# Altium schematic sheet SV601121A.SchDoc: BUCK/BOOST CONVERTER HIGH DENSITY
size 431 x 279 mm; DrawnBy: Alan Cuperus; DocumentNumber: 2; Revision: A; SheetNumber: 2; SheetTotal: 2; PageSetup: Record=PageOptions|CenterHorizontal=True|CenterVertical=True|PrintScale=0.62|XCorrection=1.00|YCorrection=1.00|PrintKind=0|BorderSize=5000000|LeftOffset=0|BottomOffset=0|Orientation=2|PaperLength=1000|PaperWidth=1000|Scale=100|PaperSource=15|PrintQuality=600|MediaType=1|DitherType=10|PaperKind=Letter (8.5 x 11")|PrintScaleMode=1
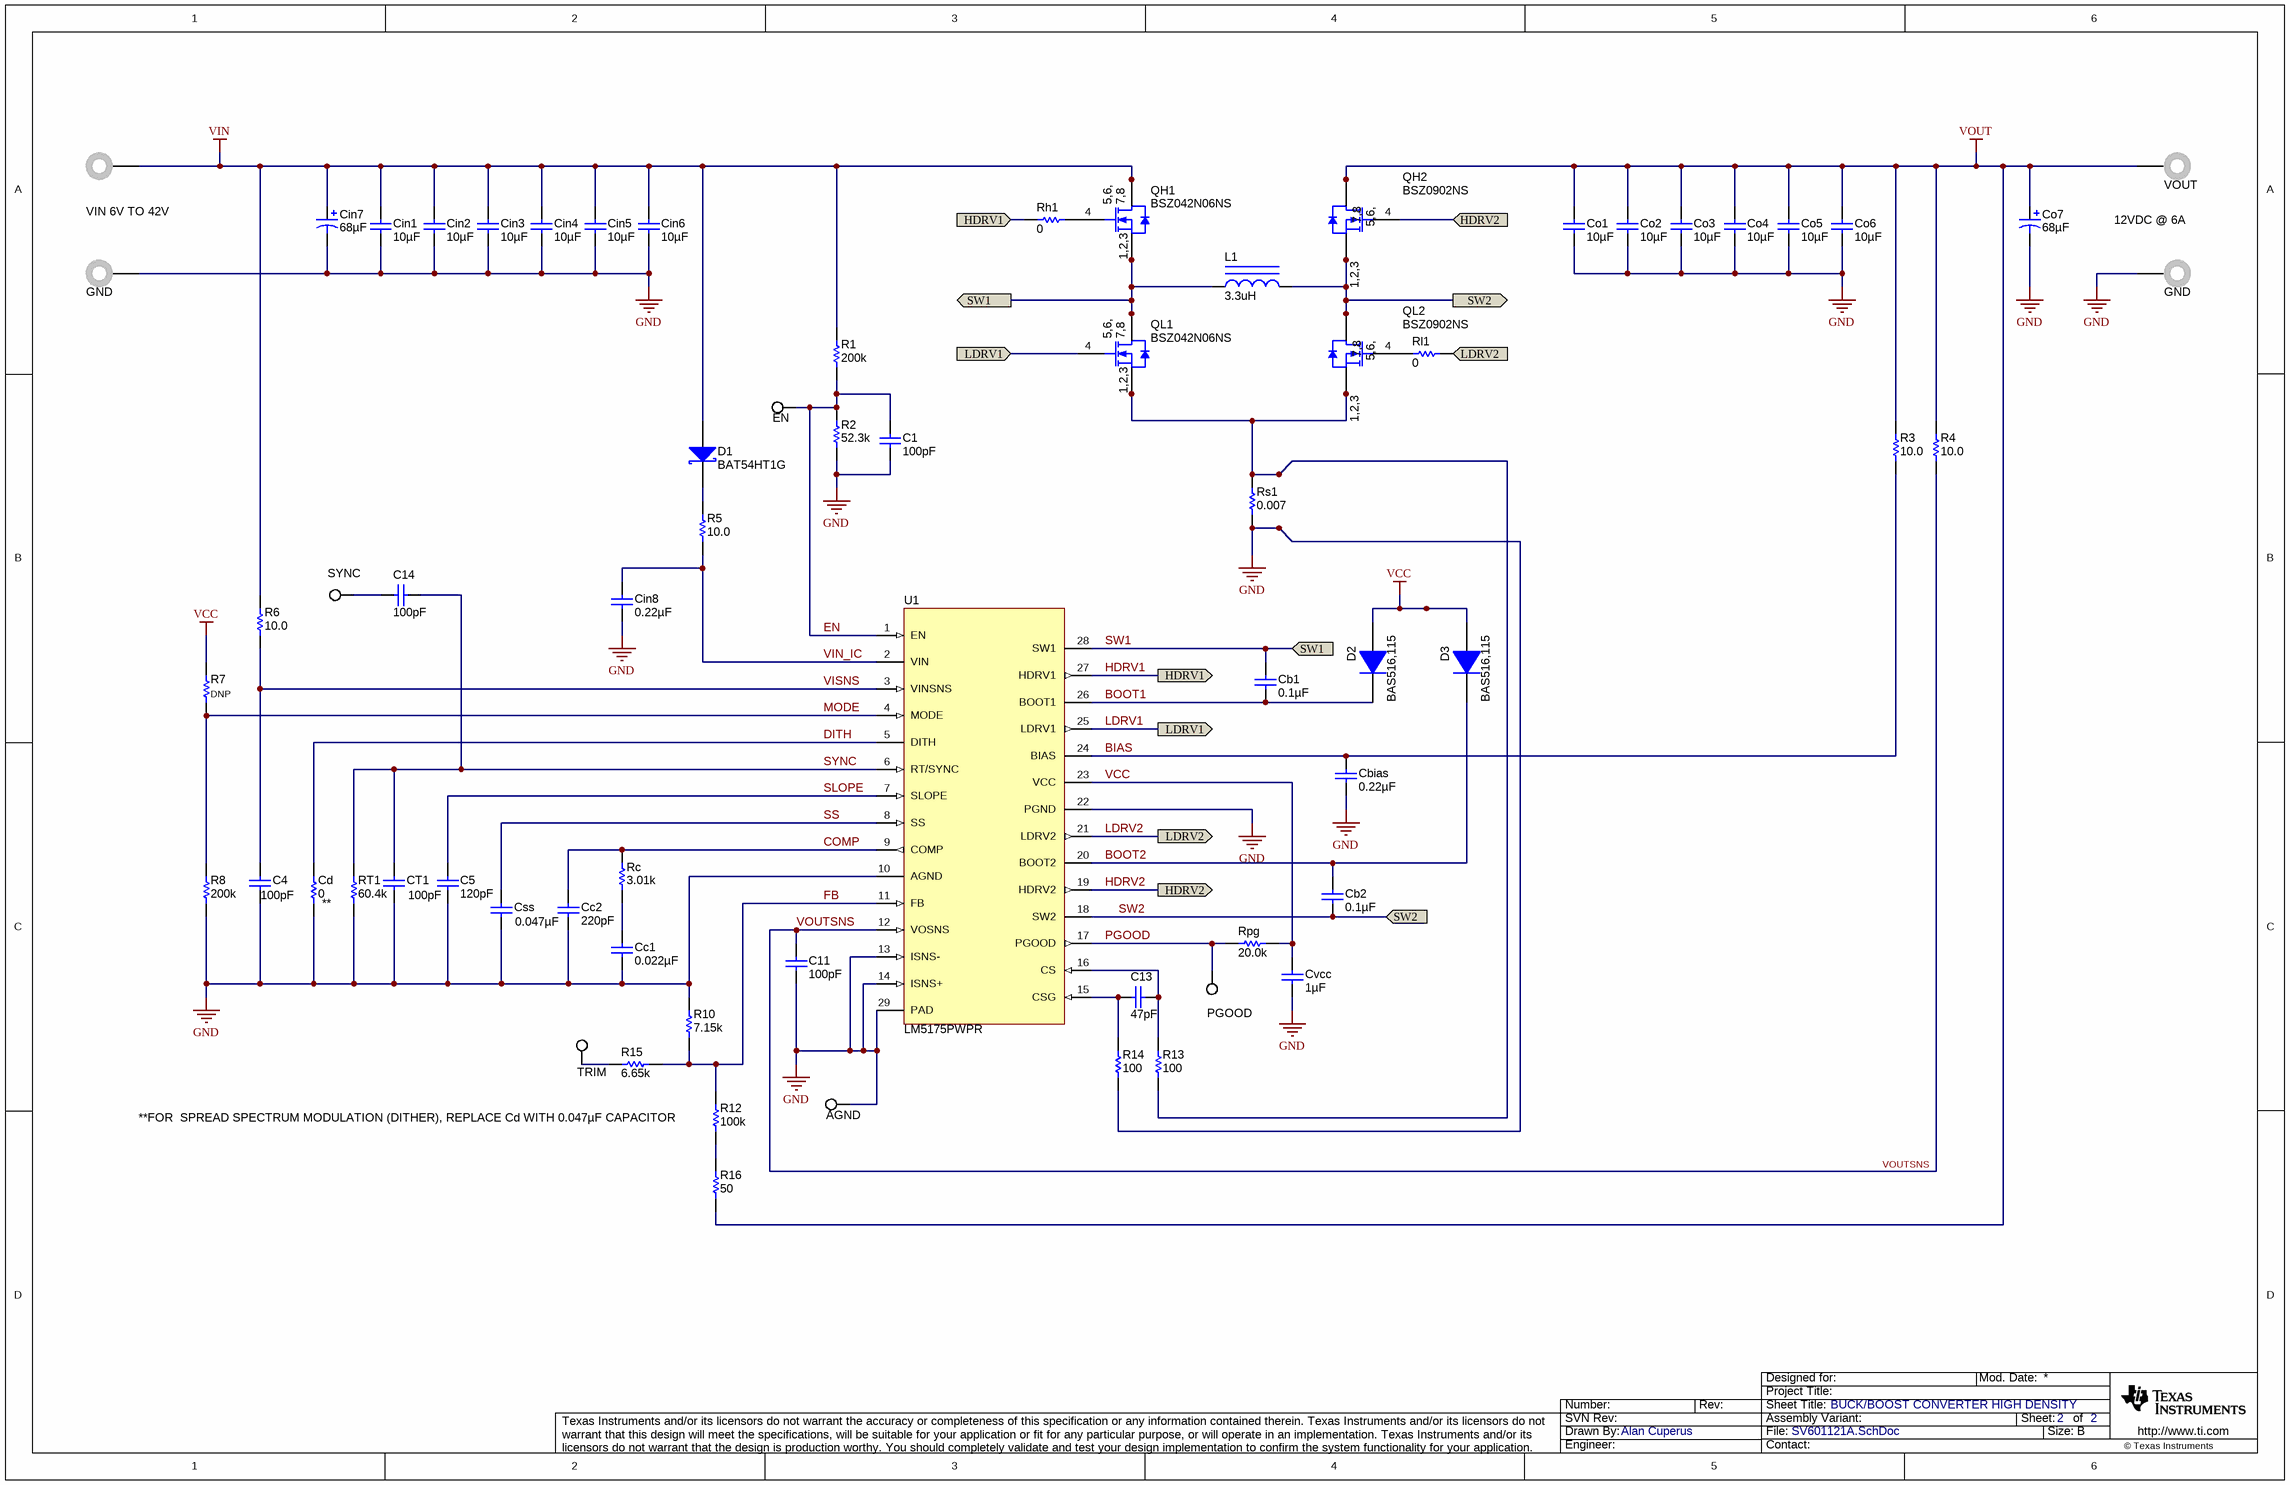
[diagram p0: SV601121A.SchDoc]

## Parts
AGND  5015  [Testpoint_Keystone_Miniature]  (value not drawn)
C1  ValueDisplayed: 100pF  [0603L]  (hidden comment: GRM1885C1H101JA01D)
C4  ValueDisplayed: 100pF  [0603L]  (hidden comment: GRM1885C1H101JA01D)
C5  ValueDisplayed: 120pF  [0603L]  (hidden comment: GRM1885C1H121JA01D)
C11  ValueDisplayed: 100pF  [0603L]  (hidden comment: GRM1885C1H101JA01D)
C13  ValueDisplayed: 47pF  [0603L]  (hidden comment: GRM1885C1H470JA01D)
C14  ValueDisplayed: 100pF  [0603L]  (hidden comment: CGA3E2NP01H101J080AA)
Cb1  ValueDisplayed: 0.1µF  [0603L]  (hidden comment: GCM188R71H104KA57D)
Cb2  ValueDisplayed: 0.1µF  [0603L]  (hidden comment: GCM188R71H104KA57D)
Cbias  ValueDisplayed: 0.22µF  [0603_HV]  (hidden comment: C1608X7R1H224K080AB)
Cc1  ValueDisplayed: 0.022µF  [0603L]  (hidden comment: GRM188R71H223KA01D)
Cc2  ValueDisplayed: 220pF  [0603L]  (hidden comment: GRM1885C1H221JA01D)
Cd  ValueDisplayed: 0  [0603L]  (hidden comment: RC0603JR-070RL)
Cin1  ValueDisplayed: 10µF  [1210L]  (hidden comment: GRM32ER71H106KA12L)
Cin2  ValueDisplayed: 10µF  [1210L]  (hidden comment: GRM32ER71H106KA12L)
Cin3  ValueDisplayed: 10µF  [1210L]  (hidden comment: GRM32ER71H106KA12L)
Cin4  ValueDisplayed: 10µF  [1210L]  (hidden comment: GRM32ER71H106KA12L)
Cin5  ValueDisplayed: 10µF  [1210L]  (hidden comment: GRM32ER71H106KA12L)
Cin6  ValueDisplayed: 10µF  [1210L]  (hidden comment: GRM32ER71H106KA12L)
Cin7  ValueDisplayed: 68µF  [SM_RADIAL_8MM]  (hidden comment: EEHZC1H680P)
Cin8  ValueDisplayed: 0.22µF  [0603_HV]  (hidden comment: C1608X7R1H224K080AB)
Co1  ValueDisplayed: 10µF  [1210L]  (hidden comment: GRM32ER71H106KA12L)
Co2  ValueDisplayed: 10µF  [1210L]  (hidden comment: GRM32ER71H106KA12L)
Co3  ValueDisplayed: 10µF  [1210L]  (hidden comment: GRM32ER71H106KA12L)
Co4  ValueDisplayed: 10µF  [1210L]  (hidden comment: GRM32ER71H106KA12L)
Co5  ValueDisplayed: 10µF  [1210L]  (hidden comment: GRM32ER71H106KA12L)
Co6  ValueDisplayed: 10µF  [1210L]  (hidden comment: GRM32ER71H106KA12L)
Co7  ValueDisplayed: 68µF  [SM_RADIAL_8MM]  (hidden comment: EEHZC1H680P)
Css  ValueDisplayed: 0.047µF  [0603L]  (hidden comment: GRM188R71H473KA61D)
CT1  ValueDisplayed: 100pF  [0603L]  (hidden comment: DNP)
Cvcc  ValueDisplayed: 1µF  [0603L]  (hidden comment: GRM188R71C105KA12D)
D1  BAT54HT1G  [sod-323]
D2  BAS516,115  [SOD-523]
D3  BAS516,115  [SOD-523]
EN  5015  [Testpoint_Keystone_Miniature]  (value not drawn)
J1  VIN 6V TO 42V  [Johnson_108-0740-001]
J2  VOUT  [Johnson_108-0740-001]
J3  GND  [Johnson_108-0740-001]
J4  GND  [Johnson_108-0740-001]
L1  3.3uH  [PIMB135T]
PGOOD  5015  [Testpoint_Keystone_Miniature]  (value not drawn)
QH1  BSZ042N06NS  [PG-TSDSON-8]
QH2  BSZ0902NS  [PG-TSDSON-8]
QL1  BSZ042N06NS  [PG-TSDSON-8]
QL2  BSZ0902NS  [PG-TSDSON-8]
R1  value 200k  [0603_HV]  (hidden comment: RC0603FR-07200KL)
R2  ValueDisplayed: 52.3k  [0603_HV]  (hidden comment: RC0603FR-0752K3L)
R3  value 10.0  [0603_HV]  (hidden comment: RC0603FR-0710RL)
R4  ValueDisplayed: 10.0  [0603L]  (hidden comment: CRCW060310R0FKEA)
R5  value 10.0  [0603L]  (hidden comment: RC0603FR-0710RL)
R6  value 10.0  [0603L]  (hidden comment: RC0603FR-0710RL)
R7  value DNP  [0603L]  (hidden comment: CRCW06030000Z0EA)
R8  ValueDisplayed: 200k  [0603L]  (hidden comment: CRCW0603200KFKEA)
R10  value 7.15k  [0603L]  (hidden comment: RC0603FR-077K15L)
R12  value 100k  [0603L]  (hidden comment: RC0603FR-07100KL)
R13  value 100  [0603L]  (hidden comment: RC0603FR-07100RL)
R14  value 100  [0603L]  (hidden comment: RC0603FR-07100RL)
R15  ValueDisplayed: 6.65k  [0603L]  (hidden comment: RC0603FR-076K65L)
R16  ValueDisplayed: 50  [0603L]  (hidden comment: CRCW060350R0FKEA)
Rc  value 3.01k  [0603L]  (hidden comment: RC0603FR-073K01L)
Rh1  value 0  [0603L]  (hidden comment: CRCW06030000Z0EA)
Rl1  value 0  [0603L]  (hidden comment: CRCW06030000Z0EA)
Rpg  ValueDisplayed: 20.0k  [0603L]  (hidden comment: RC0603FR-0720KL)
Rs1  0.007  [2512_WIDE]
RT1  ValueDisplayed: 60.4k  [0603L]  (hidden comment: RC0603FR-0760K4L)
SYNC  5015  [Testpoint_Keystone_Miniature]  (value not drawn)
TRIM  5015  [Testpoint_Keystone_Miniature]  (value not drawn)
U1  LM5175PWPR  [PWP0028F_N]

## Ports
HDRV1, HDRV2, LDRV1, LDRV2, SW1, SW2

## Nets
GND: AGND.1 C1.1 C4.1 C5.2 C11.2 Cbias.2 Cc1.2 Cc2.1 Cd.1 Cin1.2 Cin2.2 Cin3.2 Cin4.2 Cin5.2 Cin6.2 Cin7.2(-) Cin8.2 Co1.2 Co2.2 Co3.2 Co4.2 Co5.2 Co6.2 Co7.2(-) Css.2 CT1.1 Cvcc.2 J3.1 J4.1 R2.1 R8.1 R10.2 R14.2 Rs1.1 RT1.1 U1.10(AGND) U1.13(ISNS-) U1.14(ISNS+) U1.22(PGND) U1.29(PAD)
VCC: Cvcc.1 D2.2(A) D3.2(A) R7.2 Rpg.1 U1.23(VCC)
VIN: Cin1.1 Cin2.1 Cin3.1 Cin4.1 Cin5.1 Cin6.1 Cin7.1(+) D1.2(A) J1.1 QH1.5(D) QH1.6(D) QH1.7(D) QH1.8(D) QH1.9(D) R1.2 R6.1
VOUT: Co1.1 Co2.1 Co3.1 Co4.1 Co5.1 Co6.1 Co7.1(+) J2.1 QH2.5(D) QH2.6(D) QH2.7(D) QH2.8(D) QH2.9(D) R3.2 R4.2 R16.1
BIAS: Cbias.1 R3.1 U1.24(BIAS)
BOOT1: Cb1.1 D2.1(K) U1.26(BOOT1)
BOOT2: Cb2.2 D3.1(K) U1.20(BOOT2)
COMP: Cc2.2 Rc.2 U1.9(COMP)
DITH: Cd.2 U1.5(DITH)
EN: C1.2 EN.1 R1.1 R2.2 U1.1(EN)
FB: R10.1 R12.2 R15.2 U1.11(FB)
HDRV1: Rh1.1 U1.27(HDRV1) ; port HDRV1
HDRV2: QH2.4(G) U1.19(HDRV2) ; port HDRV2
LDRV1: QL1.4(G) U1.25(LDRV1) ; port LDRV1
LDRV2: Rl1.2 U1.21(LDRV2) ; port LDRV2
MODE: R7.1 R8.2 U1.4(MODE)
PGOOD: PGOOD.1 Rpg.2 U1.17(PGOOD)
SLOPE: C5.1 U1.7(SLOPE)
SS: Css.1 U1.8(SS)
SW1: Cb1.2 L1.1 QH1.1(S) QH1.2(S) QH1.3(S) QL1.5(D) QL1.6(D) QL1.7(D) QL1.8(D) QL1.9(D) U1.28(SW1) ; port SW1
SW2: Cb2.1 L1.2 QH2.1(S) QH2.2(S) QH2.3(S) QL2.5(D) QL2.6(D) QL2.7(D) QL2.8(D) QL2.9(D) U1.18(SW2) ; port SW2
SYNC: C14.1 CT1.2 RT1.2 U1.6(RT/SYNC)
VIN_IC: Cin8.1 R5.1 U1.2(VIN)
VISNS: C4.2 R6.2 U1.3(VINSNS)
VOUTSNS: C11.1 R4.1 U1.12(VOSNS)
NetC13_1: C13.1 R14.1 U1.15(CSG)
NetC13_2: C13.2 R13.1 U1.16(CS)
NetC14_2: C14.2 SYNC.1
NetCc1_1: Cc1.1 Rc.1
NetD1_1: D1.1(K) R5.2
NetQH1_4: QH1.4(G) Rh1.2
NetQL1_1: QL1.1(S) QL1.2(S) QL1.3(S) QL2.1(S) QL2.2(S) QL2.3(S) R13.2 Rs1.2
NetQL2_4: QL2.4(G) Rl1.1
NetR12_1: R12.1 R16.2
NetR15_1: R15.1 TRIM.1

## Notes on the sheet
- 12VDC @ 6A
- (near Cd) **
- **FOR  SPREAD SPECTRUM MODULATION (DITHER), REPLACE Cd WITH 0.047µF CAPACITOR
- Drawn By:
- SVN Rev:
- Number:
- Rev:
- Sheet Title:
- File:
- Project Title:
- Designed for:
- Assembly Variant:
- Mod. Date:
- Sheet:
- Size:
- of
- B
- http://www.ti.com
- Texas Instruments and/or its licensors do not warrant the accuracy or completeness of this specification or any information contained therein. Texas Instruments and/or its licensors do not warrant that this design will meet the specifications, will be suitable for your application or fit for any particular purpose, or will operate in an implementation. Texas Instruments and/or its licensors do not warrant that the design is production worthy. You should completely validate and test your design implementation to confirm the system functionality for your application.
- Engineer:
- Contact:
- © Texas Instruments
- (in symbol BSZ042N06NS) 5,6,; 7,8; 1,2,3
- (in symbol BSZ0902NS) 7,8; 5,6,; 1,2,3

## Library data of the parts
AGND EN PGOOD SYNC TRIM = 5015: Test Point, Miniature, SMT; Manufacturer: Keystone; CompType: Test Point Loop; U/M: EA; SymbolVersion: 2008-07-10; PartNumber: 5015; Value: SMT; RoHS: Y; PackageReference: Testpoint_Keystone_Miniature; MountType: SMT; ComponentLink1Description: Datasheet Link; ComponentLink1URL: http://www.keyelco.com/userAssets/store/files/5015.PDF; Publisher: Texas Instruments; LatestRevisionDate: 2014-05-06; Supplier 1: Digi-Key; Supplier Part Number 1: 5015KCT-ND
C1 C4 C11 CT1 = GRM1885C1H101JA01D: CAP, CERM, 100pF, 50V, +/-5%, C0G/NP0, 0603; Manufacturer: MuRata; Polarized: N; CompType: Capacitor; U/M: EA; Cap_F: 0.0000000001; Tolerance_%: 5; Value1: Unknown; VDC_V: 50; TaMin_C: -55; TaMax_C: 125; Cap_Case: 0603; SymbolVersion: 2008-07-09; Value: 100pF; PartNumber: GRM1885C1H101JA01D; PackageReference: 0603; RoHS: Y; Value2: 50V; MountType: SMT; Technology: Ceramic; TempCo: C0G/NP0; Published: 2008-06-19; Publisher: Texas Instruments; ComponentLink1Description: Datasheet link; ComponentLink1URL: http://search.murata.co.jp/Ceramy/PnsearchViewAction.do?HnOFG=ON&HnNFG=ON&SEL_CNT=50&sLang=en&sKey=GRM1885C1H101JA01D&x=9&y=9&search=startwith; Supplier 1: Digi-Key; Supplier Part Number 1: 490-1427-1-ND; Supplier 2: Mouser; Supplier Part Number 2: 81-GRM39C101J50; Supplier 3: Farnell; Supplier Part Number 3: 8819866
  C1 C4: LatestRevisionDate: 2013-08-08
  C11: LatestRevisionDate: 2014-05-15
  CT1: LatestRevisionDate: 2013-08-08; Comment_1: GRM1885C1H101JA01D
C5 = GRM1885C1H121JA01D: CAP, CERM, 120pF, 50V, +/-5%, C0G/NP0, 0603; Manufacturer: MuRata; Polarized: N; CompType: Capacitor; U/M: EA; Cap_F: 0.00000000012; Tolerance_%: 5; Value1: Unknown; VDC_V: 50; TaMin_C: -55; TaMax_C: 125; Cap_Case: 0603; SymbolVersion: 2008-07-09; Value: 120pF; PartNumber: GRM1885C1H121JA01D; PackageReference: 0603; RoHS: Y; Value2: 50V; MountType: SMT; Technology: Ceramic; TempCo: C0G/NP0; Published: 2008-06-19; Publisher: Texas Instruments; LatestRevisionDate: 2014-05-15; ComponentLink1Description: Datasheet link; ComponentLink1URL: http://search.murata.co.jp/Ceramy/PnsearchViewAction.do?HnOFG=ON&HnNFG=ON&SEL_CNT=50&sLang=en&sKey=GRM1885C1H121JA01D&x=9&y=9&search=startwith; Supplier 1: Digi-Key; Supplier Part Number 1: 490-1429-1-ND; Supplier 2: Mouser; Supplier Part Number 2: 81-GRM39C121J50; Supplier 3: Farnell; Supplier Part Number 3: 1403555
C13 = GRM1885C1H470JA01D: CAP, CERM, 47pF, 50V, +/-5%, C0G/NP0, 0603; Manufacturer: MuRata; Polarized: N; CompType: Capacitor; U/M: EA; Cap_F: 0.000000000047; Tolerance_%: 5; Value1: Unknown; VDC_V: 50; TaMin_C: -55; TaMax_C: 125; Cap_Case: 0603; SymbolVersion: 2008-07-09; Value: 47pF; PartNumber: GRM1885C1H470JA01D; PackageReference: 0603; RoHS: Y; Value2: 50V; MountType: SMT; Technology: Ceramic; TempCo: C0G/NP0; Published: 2008-06-19; Publisher: Texas Instruments; LatestRevisionDate: 2014-05-15; ComponentLink1Description: Datasheet link; ComponentLink1URL: http://search.murata.co.jp/Ceramy/PnsearchViewAction.do?HnOFG=ON&HnNFG=ON&SEL_CNT=50&sLang=en&sKey=GRM1885C1H470JA01D&x=9&y=9&search=startwith; Supplier 1: Digi-Key; Supplier Part Number 1: 490-1419-1-ND; Supplier 2: Mouser; Supplier Part Number 2: 81-GRM39C470J50; Supplier 3: Farnell; Supplier Part Number 3: 8819840
C14 = CGA3E2NP01H101J080AA: CAP, CERM, 100pF, 50V, +/-5%, C0G/NP0, 0603; Manufacturer: TDK; Polarized: N; CompType: Capacitor; U/M: EA; Cap_F: 0.0000000001; Tolerance_%: 5; Value1: Unknown; VDC_V: 50; TaMin_C: -55; TaMax_C: 150; Cap_Case: 0603; SymbolVersion: 2008-07-09; Value: 100pF; PartNumber: CGA3E2NP01H101J080AA; PackageReference: 0603; RoHS: Y; Value2: 50V; MountType: SMT; Technology: Ceramic; TempCo: C0G/NP0; Published: 2008-06-19; Publisher: Texas Instruments; LatestRevisionDate: 2014-05-15; ComponentLink1Description: Datasheet link; ComponentLink1URL: http://www.tdk.com/pdf/mlcc_prod_guide/MLCC%20Product%20Guide%20A13.pdf; Supplier 1: Digi-Key; Supplier Part Number 1: 445-12386-1-ND
Cb1 Cb2 = GCM188R71H104KA57D: CAP, CERM, 0.1uF, 50V, +/-10%, X7R, 0603; Manufacturer: MuRata; Polarized: N; CompType: Capacitor; U/M: EA; Cap_F: 0.0000001; Tolerance_%: 10; ESR_Ohm: 0.02; Value1: 0.02 ohm; VDC_V: 50; IRMS_A: 1.84; TaMin_C: -55; TaMax_C: 125; Cap_Case: 0603; SymbolVersion: 2008-07-09; Value: 0.1uF; PartNumber: GCM188R71H104KA57D; PackageReference: 0603; RoHS: Y; Value2: 50V; MountType: SMT; Technology: Ceramic; TempCo: X7R; Published: 2008-06-19; Publisher: Texas Instruments; LatestRevisionDate: 2014-05-15; ComponentLink1Description: Datasheet link; ComponentLink1URL: http://psearch.murata.com/capacitor/product/GCM188R71H104KA57%23.pdf; Supplier 1: Digi-Key; Supplier Part Number 1: 490-4779-1-ND; Supplier 2: Mouser; Supplier Part Number 2: 81-GCM188R71H104KA7D
Cbias Cin8 = C1608X7R1H224K080AB: CAP, CERM, 0.22uF, 50V, +/-10%, X7R, 0603; Manufacturer: TDK; Polarized: N; CompType: Capacitor; U/M: EA; Cap_F: 0.00000022; Tolerance_%: 10; Value1: Unknown; VDC_V: 50; TaMin_C: -55; TaMax_C: 125; Cap_Case: 0603; SymbolVersion: 2008-07-09; Value: 0.22uF; PartNumber: C1608X7R1H224K080AB; PackageReference: 0603; RoHS: Y; Value2: 50V; MountType: SMT; Technology: Ceramic; TempCo: X7R; Published: 2008-06-19; Publisher: Texas Instruments; ComponentLink1Description: Datasheet link; ComponentLink1URL: http://product.tdk.com/capacitor/mlcc/en/documents/mlcc_commercial_general_en.pdf; Supplier 1: Digi-Key; Supplier Part Number 1: 445-7408-1-ND; Supplier 2: Mouser; Supplier Part Number 2: 810-C1608X7R1H224K; Supplier 3: Farnell; Supplier Part Number 3: 2346906
  Cbias: LatestRevisionDate: 2014-05-07
  Cin8: LatestRevisionDate: 2014-05-28
Cc1 = GRM188R71H223KA01D: CAP, CERM, 0.022 µF, 50 V, +/- 10%, X7R, 0603; Manufacturer: MuRata; Polarized: N; CompType: Capacitor; Value: 0.022uF; U/M: EA; Cap_F: 0.000000022; Tolerance_%: 10; Value1: Unknown; VDC_V: 50; Value2: 50V; TaMin_C: -55; TaMax_C: 125; Cap_Case: 0603; SymbolVersion: 2008-07-09; PartNumber: GRM188R71H223KA01D; PackageReference: 0603; RoHS: Y; MountType: SMT; Technology: Ceramic; TempCo: X7R; Published: 2008-06-19; Publisher: Texas Instruments; LatestRevisionDate: 2014-08-06; ComponentLink1Description: Datasheet link; ComponentLink1URL: http://search.murata.co.jp/Ceramy/PnsearchViewAction.do?HnOFG=ON&HnNFG=ON&SEL_CNT=50&sLang=en&sKey=GRM188R71H223KA01D&x=9&y=9&search=startwith; Supplier 1: Digi-Key; Supplier Part Number 1: 490-1517-1-ND; Supplier 2: Mouser; Supplier Part Number 2: 81-GRM39X223K50D; Supplier 3: Farnell; Supplier Part Number 3: 8819998
Cc2 = GRM1885C1H221JA01D: CAP, CERM, 220 pF, 50 V, +/- 5%, C0G/NP0, 0603; Manufacturer: MuRata; Polarized: N; CompType: Capacitor; Value: 220pF; U/M: EA; Cap_F: 0.00000000022; Tolerance_%: 5; Value1: Unknown; VDC_V: 50; Value2: 50V; TaMin_C: -55; TaMax_C: 125; Cap_Case: 0603; SymbolVersion: 2008-07-09; PartNumber: GRM1885C1H221JA01D; PackageReference: 0603; RoHS: Y; MountType: SMT; Technology: Ceramic; TempCo: C0G/NP0; Published: 2008-06-19; Publisher: Texas Instruments; LatestRevisionDate: 2014-08-13; ComponentLink1Description: Datasheet link; ComponentLink1URL: http://search.murata.co.jp/Ceramy/PnsearchViewAction.do?HnOFG=ON&HnNFG=ON&SEL_CNT=50&sLang=en&sKey=GRM1885C1H221JA01D&x=9&y=9&search=startwith; Supplier 1: Digi-Key; Supplier Part Number 1: 490-1435-1-ND; Supplier 2: Mouser; Supplier Part Number 2: 81-GRM39C221J50; Supplier 3: Farnell; Supplier Part Number 3: 8819882
Cd = RC0603JR-070RL: RES, 0, 5%, 0.1 W, 0603; Manufacturer: Yageo America; CompType: Resistor; Value: 0; Tolerance_%: 5; Value2: 0.1W; VDC_V: 50; TempCo: 200 ppm/C; U/M: EA; Value_Code: 0000; Power_W: 0.1; EIA_Code: E24; SymbolVersion: 2009-05-29; PartNumber: RC0603JR-070RL; PackageReference: 0603; RoHS: Y; Value1: 5%; MountType: SMT; Technology: Thick Film; Published: 2008-06-26; Publisher: Texas Instruments; LatestRevisionDate: 2014-07-30; ComponentLink1Description: Datasheet link; ComponentLink1URL: http://www.yageo.com/pdf/Pu-RC0603_51_PbFree_L_2.pdf; Supplier 1: Digi-Key; Supplier Part Number 1: 311-0.0GRCT-ND; Supplier 2: Mouser; Supplier Part Number 2: 603-RC0603JR-070RL; Supplier 3: Farnell; Supplier Part Number 3: 9233130; Res_ohm: 0
Cin1-Cin6 = GRM32ER71H106KA12L: CAP, CERM, 10uF, 50V, +/-10%, X7R, 1210; Manufacturer: MuRata; Polarized: N; CompType: Capacitor; U/M: EA; Cap_F: 0.00001; Tolerance_%: 10; Value1: Unknown; VDC_V: 50; TaMin_C: -55; TaMax_C: 125; Cap_Case: 1210; SymbolVersion: 2008-07-09; Value: 10uF; PartNumber: GRM32ER71H106KA12L; PackageReference: 1210; RoHS: Y; Value2: 50V; MountType: SMT; Technology: Ceramic; TempCo: X7R; Published: 2008-06-19; Publisher: Texas Instruments; LatestRevisionDate: 2014-05-07; ComponentLink1Description: Datasheet link; ComponentLink1URL: http://www.murata.com/products/catalog/pdf/c02e.pdf; Supplier 1: Digi-Key; Supplier Part Number 1: 490-6544-1-ND; Supplier 2: Mouser; Supplier Part Number 2: 81-GRM32ER71H106KA2L
Cin7 Co7 = EEHZC1H680P: CAP, AL, 68 µF, 50 V, +/- 20%, 30 ohm, SMD; Manufacturer: Panasonic; Polarized: Y; CompType: Capacitor; Value: 68uF; U/M: EA; Cap_F: 0.000068; Tolerance_%: 20; Value1: 30 ohm; VDC_V: 50; Value2: 50V; ESR_ohm: 30; IRMS_A: 1.25; TaMin_C: -55; TaMax_C: 125; SymbolVersion: 2008-07-09; PartNumber: EEHZC1H680P; PackageReference: 8x10; RoHS: Y; MountType: SMT; Technology: AL; Series: ZC; Publisher: Texas Instruments; LatestRevisionDate: 2014-07-31; ComponentLink1Description: Datasheet link; ComponentLink1URL: http://industrial.panasonic.com/www-data/pdf/ABA0000/ABA0000CE138.pdf; Supplier 1: Digi-Key; Supplier Part Number 1: P15465CT-ND
Co1-Co6 = GRM32ER71H106KA12L: CAP, CERM, 10 µF, 50 V, +/- 10%, X7R, 1210; Manufacturer: MuRata; Polarized: N; CompType: Capacitor; Value: 10uF; U/M: EA; Cap_F: 0.00001; Tolerance_%: 10; Value1: Unknown; VDC_V: 50; Value2: 50V; TaMin_C: -55; TaMax_C: 125; Cap_Case: 1210; SymbolVersion: 2008-07-09; PartNumber: GRM32ER71H106KA12L; PackageReference: 1210; RoHS: Y; MountType: SMT; Technology: Ceramic; TempCo: X7R; Published: 2008-06-19; Publisher: Texas Instruments; LatestRevisionDate: 2014-08-06; ComponentLink1Description: Datasheet link; ComponentLink1URL: http://www.murata.com/products/catalog/pdf/c02e.pdf; Supplier 1: Digi-Key; Supplier Part Number 1: 490-6544-1-ND; Supplier 2: Mouser; Supplier Part Number 2: 81-GRM32ER71H106KA2L
Css = GRM188R71H473KA61D: CAP, CERM, 0.047 µF, 50 V, +/- 10%, X7R, 0603; Manufacturer: MuRata; Polarized: N; CompType: Capacitor; Value: 0.047uF; U/M: EA; Cap_F: 0.000000047; Tolerance_%: 10; Value1: Unknown; VDC_V: 50; Value2: 50V; TaMin_C: -55; TaMax_C: 125; Cap_Case: 0603; SymbolVersion: 2008-07-09; PartNumber: GRM188R71H473KA61D; PackageReference: 0603; RoHS: Y; MountType: SMT; Technology: Ceramic; TempCo: X7R; Published: 2008-06-19; Publisher: Texas Instruments; LatestRevisionDate: 2014-08-13; ComponentLink1Description: Datasheet link; ComponentLink1URL: http://search.murata.co.jp/Ceramy/PnsearchViewAction.do?HnOFG=ON&HnNFG=ON&SEL_CNT=50&sLang=en&sKey=GRM188R71H473KA61D&x=9&y=9&search=startwith; Supplier 1: Digi-Key; Supplier Part Number 1: 490-3287-1-ND; Supplier 2: Mouser; Supplier Part Number 2: 81-GRM188R71H473KA61; Supplier 3: Farnell; Supplier Part Number 3: 8820015
Cvcc = GRM188R71C105KA12D: CAP, CERM, 1uF, 16V, +/-10%, X7R, 0603; Manufacturer: MuRata; Polarized: N; CompType: Capacitor; U/M: EA; Cap_F: 0.000001; Tolerance_%: 10; ESR_Ohm: 0.011; Value1: 0.011 ohm; VDC_V: 16; TaMin_C: -55; TaMax_C: 125; Cap_Case: 0603; SymbolVersion: 2008-07-09; Value: 1uF; PartNumber: GRM188R71C105KA12D; PackageReference: 0603; RoHS: Y; Value2: 16V; MountType: SMT; Technology: Ceramic; TempCo: X7R; Published: 2008-06-19; Publisher: Texas Instruments; LatestRevisionDate: 2013-07-21; ComponentLink1Description: Datasheet link; ComponentLink1URL: http://search.murata.co.jp/Ceramy/PnsearchViewAction.do?HnOFG=ON&HnNFG=ON&SEL_CNT=50&sLang=en&sKey=GRM188R71C105KA12D&x=9&y=9&search=startwith; Supplier 1: Digi-Key; Supplier Part Number 1: 490-3900-1-ND; Supplier 2: Mouser; Supplier Part Number 2: 81-GRM188R71C105KA12; Supplier 3: Farnell; Supplier Part Number 3: 1828826
D1 = BAT54HT1G: Diode, Schottky, 30V, 0.2A, SOD-323; Manufacturer: ON Semiconductor; U/M: EA; Vf_V: 0.35; Value2: 0.35V; Io_A: 0.2; Vr_V: 30; CompType: Diode; SymbolVersion: 2008-12-08; Value: 30V; PartNumber: BAT54HT1G; PackageReference: SOD-323; Value1: 0.2A; MountType: SMT; Type: Schottky; Published: 2008-06-26; Publisher: Texas Instruments; LatestRevisionDate: 2014-05-07; ComponentLink1Description: Datasheet link; ComponentLink1URL: http://www.onsemi.com/pub/Collateral/BAT54HT1-D.PDF; Supplier 1: Digi-Key; Supplier Part Number 1: BAT54HT1OSCT-ND; Supplier 2: Mouser; Supplier Part Number 2: 863-BAT54HT1G; Supplier 3: Farnell; Supplier Part Number 3: 1459033
D2 D3 = BAS516,115: Diode, Switching, 100V, 0.25A, SOD-523; Manufacturer: NXP Semiconductor; U/M: EA; Vf_V: 1.25; Value2: 1.25V; Io_A: 0.25; Vr_V: 100; TJmax_C: 150; SymbolVersion: 2008-12-08; PartNumber: BAS516,115; PackageReference: SOD-523; CompType: Diode; Value: 100V; Value1: 0.25A; MountType: SMT; Type: Switching; RoHS: Y; Published: 2008-06-26; Publisher: Texas Instruments; LatestRevisionDate: 2014-08-29; ComponentLink1Description: Datasheet link; ComponentLink1URL: http://www.nxp.com/documents/data_sheet/BAS16_SER.pdf; Supplier 1: Digi-Key; Supplier Part Number 1: 568-1603-1-ND; Supplier 2: Mouser; Supplier Part Number 2: 771-BAS516-T/R; Supplier 3: Farnell; Supplier Part Number 3: 8734402
J1-J4 = 108-0740-001: Standard Banana Jack, Uninsulated, 15A; Manufacturer: Emerson Network Power; SymbolCreator: a0412235; CompType: Connector; U/M: EA; SymbolVersion: 2009-09-23; PartNumber: 108-0740-001; RoHS: Y; PackageReference: Banana Jack; MountType: TH; ComponentLink1Description: Datasheet Link; ComponentLink1URL: http://emersonnetworkpower.com/webapp/wcs/stores/servlet/ESC/resources/1080740001.pdf; Publisher: Texas Instruments; LatestRevisionDate: 2014-05-06; Supplier 1: Digi-Key; Supplier Part Number 1: J147-ND; Supplier 2: Mouser; Supplier Part Number 2: 530-108-0740-1
L1 = PIMB135T-3R3MS: Inductor, Drum Core, Powdered Iron, 3.3uH, 14A, 0.007 ohm, SMD; Manufacturer: Cyntec; ValueDisplayed: 3.3µH; Ind_H: 3.3E-6; Imax_A: 14; Irms: 14A @ 40C rise; Isat: 22A @ 30% inductance drop; DCR_ohm: 0.007; SymbolVersion: 2008-07-23; CompType: Inductor; Value: 3.3uH; PartNumber: PIMB135T-3R3MS; PackageReference: 13.45x4.8x12.6mm; Value1: 0.007 ohm; Value2: 14A; Technology: Drum Core; MountType: SMT; Material: Powdered Iron; Published: 2008-06-26; Publisher: Texas Instruments; LatestRevisionDate: 2014-05-23; ComponentLink1Description: Datasheet link; ComponentLink1URL: http://www.cyntec.com/product/power_choke/download/PIMB135T.pdf; RoHS: Y
QH1 QL1 = BSZ042N06NS: MOSFET N-CH 60V 19A 8TSDSON; Manufacturer: Infineon Technologies; SymbolVersion: use current date i.e. 2008-05-20; CompType: Used in some BOM reports.  Useful for finding later.; U/M: EA, IN, or GM; SymbolCreator: Use a-id; Gate Charge (Qg) @ Vgs: 27nC @ 10V; Power - Max: 2.5W; FET Feature: Logic Level Gate; Input Capacitance (Ciss) @ Vds: 2000pF @ 30V; FET Type: MOSFET N-Channel, Metal Oxide; Current - Continuous Drain (Id) @ 25°C: 17A (Ta), 40A (Tc); Vgs(th) (Max) @ Id: 2.8V @ 36µA; Rds On (Max) @ Id, Vgs: 4.2 mOhm @ 20A, 10V; PartNumber: BSZ042N06NS; PackageReference: 8-PowerTDFN; VdsMax_V: 60V; RoHS: RoHS Compliant; MountType: Surface Mount; ComponentLink1Description: Datasheet Link; Alternate Manufacturer: -; Alternate PartNumber: -; Supplier 1: Digi-Key; Supplier Part Number 1: BSZ042N06NSCT-ND; Supplier 2: Mouser; Supplier Part Number 2: 726-BSZ042N06NSATMA1; Category: Discrete Semiconductor Products; Packaging: Cut Tape (CT); Supplier: Digi-Key; Supplier Device Package: PG-TSDSON-8 (3.3x3.3); ComponentLink2URL: http://www.infineon.com/dgdl/BSZ042N06NS_Rev2.0.pdf?folderId=db3a30431ddc9372011ebafa04517f8b&fileId=db3a3043345a30bc013465d4bf1862fd; ComponentLink2Description: http://www.infineon.com/dgdl/BSZ042N06NS_Rev2.0.pdf?folderId=db3a30431ddc9372011ebafa04517f8b&fileId=db3a3043345a30bc013465d4bf1862fd; Supplier Part Number: BSZ042N06NSCT-ND
QH2 QL2 = BSZ0902NS: MOSFET, N-CH, 30V, 40A, PG-TSDSON-8; Manufacturer: Infineon Technologies; Alternate Manufacturer: None; U/M: EA; VdsMax_V: 30; ChType: N; Value1: 0.0035 ohm; Rdson45_Ohm: 0.0035; Value2: 26 nC; QgTyp_nC: 26; Vgs_V: 20; IdsMax_A: 40; SymbolVersion: 2011-08-16; PartNumber: BSZ0902NS; PackageReference: PG-TSDSON-8; CompType: MOSFET; RoHS: Y; MountType: SMT; ComponentLink1Description: Datasheet link; ComponentLink1URL: http://www.infineon.com/dgdl/BSZ0902NS_rev2.2.pdf?folderId=db3a304313b8b5a60113cee8763b02d7&fileId=db3a30432f0d175c012f25d963971d2f; Supplier 1: Digi-Key; Supplier Part Number 1: BSZ0902NSCT-ND; Supplier 2: Mouser; Supplier Part Number 2: 726-BSZ0902NS; Value: 30V; Published: 2008-06-19; Publisher: Texas Instruments; LatestRevisionDate: 2014-08-29; LatestRevisionNote: Added parts.
R1 = RC0603FR-07200KL: RES, 200k ohm, 1%, 0.1W, 0603; Manufacturer: Yageo America; CompType: Resistor; Res_ohm: 200000; Tolerance_%: 1; Power_W: 0.1; VDC_V: 150; TempCo: 200 ppm/C; EIA_Code: E96; U/M: EA; SymbolVersion: 2009-05-29; PartNumber: RC0603FR-07200KL; PackageReference: 0603; RoHS: Y; Value_Code: 200k; Value1: 1%; Value2: 0.1W; MountType: SMT; Technology: Thick Film; Published: 2008-06-26; Publisher: Texas Instruments; LatestRevisionDate: 2014-05-20; ComponentLink1Description: Datasheet link; ComponentLink1URL: http://www.yageo.com/pdf/Pu-RC0603_51_PbFree_L_2.pdf; Supplier 1: Digi-Key; Supplier Part Number 1: 311-200KHRCT-ND; Supplier 2: Mouser; Supplier Part Number 2: 603-RC0603FR-07200KL; Supplier 3: Farnell; Supplier Part Number 3: 1799334
R2 = RC0603FR-0752K3L: RES, 52.3 k, 1%, 0.1 W, 0603; Manufacturer: Yageo America; CompType: Resistor; Value: 52.3k; Res_ohm: 52300; Value_Code: 52k3; Tolerance_%: 1; Power_W: 0.1; Value2: 0.1W; VDC_V: 150; TempCo: 200 ppm/C; EIA_Code: E96; U/M: EA; SymbolVersion: 2009-05-29; PartNumber: RC0603FR-0752K3L; PackageReference: 0603; RoHS: Y; Value1: 1%; MountType: SMT; Technology: Thick Film; Published: 2008-06-26; Publisher: Texas Instruments; LatestRevisionDate: 2014-07-30; ComponentLink1Description: Datasheet link; ComponentLink1URL: http://www.yageo.com/pdf/Pu-RC0603_51_PbFree_L_2.pdf; Supplier 1: Digi-Key; Supplier Part Number 1: 311-52.3KHRCT-ND; Supplier 2: Mouser; Supplier Part Number 2: 603-RC0603FR-0752K3L
R3 R5 R6 = RC0603FR-0710RL: RES, 10.0 ohm, 1%, 0.1W, 0603; Manufacturer: Yageo America; CompType: Resistor; Res_ohm: 10; Value_Code: 10R0; Tolerance_%: 1; Power_W: 0.1; VDC_V: 150; TempCo: 200 ppm/C; EIA_Code: E96; U/M: EA; SymbolVersion: 2009-05-29; PartNumber: RC0603FR-0710RL; PackageReference: 0603; RoHS: Y; Value1: 1%; Value2: 0.1W; MountType: SMT; Technology: Thick Film; Published: 2008-06-26; Publisher: Texas Instruments; LatestRevisionDate: 2014-05-20; ComponentLink1Description: Datasheet link; ComponentLink1URL: http://www.yageo.com/pdf/Pu-RC0603_51_PbFree_L_2.pdf; Supplier 1: Digi-Key; Supplier Part Number 1: 311-10.0HRCT-ND; Supplier 2: Mouser; Supplier Part Number 2: 603-RC0603FR-0710RL; Supplier 3: Farnell; Supplier Part Number 3: 9238247
R4 = CRCW060310R0FKEA: RES, 10.0, 1%, 0.1 W, 0603; Manufacturer: Vishay-Dale; CompType: Resistor; Res_ohm: 10; Value_Code: 10R0; Tolerance_%: 1; Power_W: 0.1; Value2: 0.1W; VDC_V: 75; TempCo: 100 ppm/C; EIA_Code: E96; U/M: EA; Value: 10.0; SymbolVersion: 2009-05-29; PartNumber: CRCW060310R0FKEA; PackageReference: 0603; RoHS: Y; Value1: 1%; MountType: SMT; Technology: Thick Film; Published: 2008-06-26; Publisher: Texas Instruments; LatestRevisionDate: 2014-12-16; ComponentLink1Description: Datasheet link; ComponentLink1URL: http://www.vishay.com/docs/20035/dcrcwe3.pdf; Supplier 1: Digi-Key; Supplier Part Number 1: 541-10.0HCT-ND; Supplier 2: Mouser; Supplier Part Number 2: 71-CRCW0603-10-E3; Supplier 3: Farnell; Supplier Part Number 3: 1469751
R7 = CRCW06030000Z0EA: RES, 0 ohm, 5%, 0.1W, 0603; Manufacturer: Vishay-Dale; CompType: Resistor; Res_ohm: 0; Value_Code: 0000; Tolerance_%: 5; Power_W: 0.1; VDC_V: 75; TempCo: 200 ppm/C; EIA_Code: E24; U/M: EA; SymbolVersion: 2009-05-29; PartNumber: CRCW06030000Z0EA; PackageReference: 0603; RoHS: Y; Value1: 5%; Value2: 0.1W; MountType: SMT; Technology: Thick Film; Published: 2008-06-26; Publisher: Texas Instruments; LatestRevisionDate: 2013-07-19; ComponentLink1Description: Datasheet link; ComponentLink1URL: http://www.vishay.com/docs/20035/dcrcwe3.pdf; Supplier 1: Digi-Key; Supplier Part Number 1: 541-0.0GCT-ND; Supplier 2: Mouser; Supplier Part Number 2: 71-CRCW0603-0-E3; Supplier 3: Farnell; Supplier Part Number 3: 1469739
R8 = CRCW0603200KFKEA: RES, 200 k, 1%, 0.1 W, 0603; Manufacturer: Vishay-Dale; CompType: Resistor; Value: 200k; Res_ohm: 200000; Tolerance_%: 1; Power_W: 0.1; Value2: 0.1W; VDC_V: 75; TempCo: 100 ppm/C; EIA_Code: E96; U/M: EA; SymbolVersion: 2009-05-29; PartNumber: CRCW0603200KFKEA; PackageReference: 0603; RoHS: Y; Value_Code: 200k; Value1: 1%; MountType: SMT; Technology: Thick Film; Published: 2008-06-26; Publisher: Texas Instruments; LatestRevisionDate: 2014-08-18; ComponentLink1Description: Datasheet link; ComponentLink1URL: http://www.vishay.com/docs/20035/dcrcwe3.pdf; Supplier 1: Digi-Key; Supplier Part Number 1: 541-200KHCT-ND; Supplier 2: Mouser; Supplier Part Number 2: 71-CRCW0603-200K-E3; Supplier 3: Farnell; Supplier Part Number 3: 1469776
R10 = RC0603FR-077K15L: RES, 7.15k ohm, 1%, 0.1W, 0603; Manufacturer: Yageo America; CompType: Resistor; Res_ohm: 7150; Value_Code: 7k15; Tolerance_%: 1; Power_W: 0.1; VDC_V: 150; TempCo: 200 ppm/C; EIA_Code: E96; U/M: EA; SymbolVersion: 2009-05-29; PartNumber: RC0603FR-077K15L; PackageReference: 0603; RoHS: Y; Value1: 1%; Value2: 0.1W; MountType: SMT; Technology: Thick Film; Published: 2008-06-26; Publisher: Texas Instruments; LatestRevisionDate: 2014-04-18; ComponentLink1Description: Datasheet link; ComponentLink1URL: http://www.yageo.com/pdf/Pu-RC0603_51_PbFree_L_2.pdf; Supplier 1: Digi-Key; Supplier Part Number 1: 311-7.15KHRCT-ND; Supplier 2: Mouser; Supplier Part Number 2: 603-RC0603FR-077K15L; Supplier 3: Farnell; Supplier Part Number 3: 1799353
R12 = RC0603FR-07100KL: RES, 100k ohm, 1%, 0.1W, 0603; Manufacturer: Yageo America; CompType: Resistor; Res_ohm: 100000; Tolerance_%: 1; Power_W: 0.1; VDC_V: 150; TempCo: 200 ppm/C; EIA_Code: E96; U/M: EA; SymbolVersion: 2009-05-29; PartNumber: RC0603FR-07100KL; PackageReference: 0603; RoHS: Y; Value_Code: 100k; Value1: 1%; Value2: 0.1W; MountType: SMT; Technology: Thick Film; Published: 2008-06-26; Publisher: Texas Instruments; LatestRevisionDate: 2014-05-20; ComponentLink1Description: Datasheet link; ComponentLink1URL: http://www.yageo.com/pdf/Pu-RC0603_51_PbFree_L_2.pdf; Supplier 1: Digi-Key; Supplier Part Number 1: 311-100KHRCT-ND; Supplier 2: Mouser; Supplier Part Number 2: 603-RC0603FR-07100KL; Supplier 3: Farnell; Supplier Part Number 3: 9238727
R13 R14 = RC0603FR-07100RL: RES, 100 ohm, 1%, 0.1W, 0603; Manufacturer: Yageo America; CompType: Resistor; Value_Code: 100R; Tolerance_%: 1; Power_W: 0.1; VDC_V: 150; TempCo: 200 ppm/C; EIA_Code: E96; U/M: EA; SymbolVersion: 2009-05-29; PartNumber: RC0603FR-07100RL; PackageReference: 0603; RoHS: Y; Res_ohm: 100; Value1: 1%; Value2: 0.1W; MountType: SMT; Technology: Thick Film; Published: 2008-06-26; Publisher: Texas Instruments; LatestRevisionDate: 2014-05-20; ComponentLink1Description: Datasheet link; ComponentLink1URL: http://www.yageo.com/pdf/Pu-RC0603_51_PbFree_L_2.pdf; Supplier 1: Digi-Key; Supplier Part Number 1: 311-100HRCT-ND; Supplier 2: Mouser; Supplier Part Number 2: 603-RC0603FR-07100RL; Supplier 3: Farnell; Supplier Part Number 3: 9238360
R15 = RC0603FR-076K65L: RES, 6.65 k, 1%, 0.1 W, 0603; Manufacturer: Yageo America; CompType: Resistor; Value: 6.65k; Res_ohm: 6650; Value_Code: 6k65; Tolerance_%: 1; Power_W: 0.1; Value2: 0.1W; VDC_V: 150; TempCo: 200 ppm/C; EIA_Code: E96; U/M: EA; SymbolVersion: 2009-05-29; PartNumber: RC0603FR-076K65L; PackageReference: 0603; RoHS: Y; Value1: 1%; MountType: SMT; Technology: Thick Film; Published: 2008-06-26; Publisher: Texas Instruments; LatestRevisionDate: 2014-07-30; ComponentLink1Description: Datasheet link; ComponentLink1URL: http://www.yageo.com/pdf/Pu-RC0603_51_PbFree_L_2.pdf; Supplier 1: Digi-Key; Supplier Part Number 1: 311-6.65KHRCT-ND; Supplier 2: Mouser; Supplier Part Number 2: 603-RC0603FR-076K65L; Supplier 3: Farnell; Supplier Part Number 3: 9238581
R16 = CRCW060350R0FKEA: RES, 50, 1%, 0.1 W, 0603; Manufacturer: Vishay-Dale; CompType: Resistor; Value: 50; Value_Code: 50R0; Tolerance_%: 1; Power_W: 0.1; Value2: 0.1W; VDC_V: 75; TempCo: 100 ppm/C; U/M: EA; SymbolVersion: 2009-05-29; PartNumber: CRCW060350R0FKEA; PackageReference: 0603; RoHS: Y; Res_ohm: 50; Value1: 1%; MountType: SMT; Technology: Thick Film; Published: 2008-06-26; Publisher: Texas Instruments; LatestRevisionDate: 2014-07-30; ComponentLink1Description: Datasheet link; ComponentLink1URL: http://www.vishay.com/docs/20035/dcrcwe3.pdf; Supplier 1: Mouser; Supplier Part Number 1: 71-CRCW0603-50-E3; Supplier 2: Farnell; Supplier Part Number 2: 2112878; Supplier 3: Newark; Supplier Part Number 3: 89M6778
Rc = RC0603FR-073K01L: RES, 3.01k ohm, 1%, 0.1W, 0603; Manufacturer: Yageo America; CompType: Resistor; Res_ohm: 3010; Value_Code: 3k01; Tolerance_%: 1; Power_W: 0.1; VDC_V: 150; TempCo: 200 ppm/C; EIA_Code: E96; U/M: EA; SymbolVersion: 2009-05-29; PartNumber: RC0603FR-073K01L; PackageReference: 0603; RoHS: Y; Value1: 1%; Value2: 0.1W; MountType: SMT; Technology: Thick Film; Published: 2008-06-26; Publisher: Texas Instruments; LatestRevisionDate: 2014-05-20; ComponentLink1Description: Datasheet link; ComponentLink1URL: http://www.yageo.com/pdf/Pu-RC0603_51_PbFree_L_2.pdf; Supplier 1: Digi-Key; Supplier Part Number 1: 311-3.01KHRCT-ND; Supplier 2: Mouser; Supplier Part Number 2: 603-RC0603FR-073K01L; Supplier 3: Farnell; Supplier Part Number 3: 9238549
Rh1 Rl1 = CRCW06030000Z0EA: RES, 0 ohm, 5%, 0.1W, 0603; Manufacturer: Vishay-Dale; CompType: Resistor; Value_Code: 0000; Tolerance_%: 5; Power_W: 0.1; VDC_V: 75; TempCo: 200 ppm/C; EIA_Code: E24; U/M: EA; SymbolVersion: 2009-05-29; PartNumber: CRCW06030000Z0EA; PackageReference: 0603; RoHS: Y; Res_ohm: 0; Value1: 5%; Value2: 0.1W; MountType: SMT; Technology: Thick Film; Published: 2008-06-26; Publisher: Texas Instruments; LatestRevisionDate: 2013-07-19; ComponentLink1Description: Datasheet link; ComponentLink1URL: http://www.vishay.com/docs/20035/dcrcwe3.pdf; Supplier 1: Digi-Key; Supplier Part Number 1: 541-0.0GCT-ND; Supplier 2: Mouser; Supplier Part Number 2: 71-CRCW0603-0-E3; Supplier 3: Farnell; Supplier Part Number 3: 1469739
Rpg = RC0603FR-0720KL: RES, 20.0 k, 1%, 0.1 W, 0603; Manufacturer: Yageo America; CompType: Resistor; Value: 20.0k; Res_ohm: 20000; Value_Code: 20k0; Tolerance_%: 1; Power_W: 0.1; Value2: 0.1W; VDC_V: 150; TempCo: 200 ppm/C; EIA_Code: E96; U/M: EA; SymbolVersion: 2009-05-29; PartNumber: RC0603FR-0720KL; PackageReference: 0603; RoHS: Y; Value1: 1%; MountType: SMT; Technology: Thick Film; Published: 2008-06-26; Publisher: Texas Instruments; LatestRevisionDate: 2014-07-30; ComponentLink1Description: Datasheet link; ComponentLink1URL: http://www.yageo.com/pdf/Pu-RC0603_51_PbFree_L_2.pdf; Supplier 1: Digi-Key; Supplier Part Number 1: 311-20.0KHRCT-ND; Supplier 2: Mouser; Supplier Part Number 2: 603-RC0603FR-0720KL; Supplier 3: Farnell; Supplier Part Number 3: 1799331
Rs1 = KRL6432E-M-R007-F-T1: RES 0.007 OHM 3W 1% 2512 WIDE; Manufacturer: Susumu; CompType: Used in some BOM reports.  Useful for finding later.; SymbolVersion: use current date i.e. 2008-05-20; TempCo: ±50ppm/°C; U/M: EA, IN, or GM; SymbolCreator: Use a-id; Value: 0.007; PartNumber: KRL6432E-M-R007-F-T1; PackageReference: Wide 2512 (6432 Metric), 1225; RoHS: RoHS Compliant; Tolerance_%: ±1%; Power_W: 3W; MountType: SMT, TH, or N/A; Technology: Current Sense; ComponentLink1Description: Datasheet Link; Alternate Manufacturer: -; Alternate PartNumber: -; Supplier 1: Digi-Key; Supplier Part Number 1: 408-1617-1-ND; Supplier 2: Mouser; Supplier Part Number 2: 754-KRL6432EMR007FT1; Supplier: Digi-Key; Category: Resistors; Supplier Device Package: 6432; Height: 0.028" (0.70mm); Number of Terminations: 2; Packaging: Cut Tape (CT); Size / Dimension: 0.122" L x 0.248" W (3.10mm x 6.30mm); ComponentLink2URL: http://www.susumu-usa.com/pdf/KRL_New_Long_Data_sheet.pdf; ComponentLink2Description: http://www.susumu-usa.com/pdf/KRL_New_Long_Data_sheet.pdf; Supplier Part Number: 408-1617-1-ND
RT1 = RC0603FR-0760K4L: RES, 60.4 k, 1%, 0.1 W, 0603; Manufacturer: Yageo America; CompType: Resistor; Value: 60.4k; Res_ohm: 60400; Value_Code: 60k4; Tolerance_%: 1; Power_W: 0.1; Value2: 0.1W; VDC_V: 150; TempCo: 200 ppm/C; EIA_Code: E96; U/M: EA; SymbolVersion: 2009-05-29; PartNumber: RC0603FR-0760K4L; PackageReference: 0603; RoHS: Y; Value1: 1%; MountType: SMT; Technology: Thick Film; Published: 2008-06-26; Publisher: Texas Instruments; LatestRevisionDate: 2014-07-30; ComponentLink1Description: Datasheet link; ComponentLink1URL: http://www.yageo.com/pdf/Pu-RC0603_51_PbFree_L_2.pdf; Supplier 1: Digi-Key; Supplier Part Number 1: 311-60.4KHRCT-ND; Supplier 2: Mouser; Supplier Part Number 2: 603-RC0603FR-0760K4L
U1 = LM5175PWPR: 42V Wide VIN 4-Switch Synchronous Buck-Boost Controller, PWP0028F; Alternate Manufacturer: Texas Instruments; Alternate PartNumber: LM5175PWPT; SymbolCreator: a0411947; CompType: IC; U/M: EA; SymbolVersion: 2014-03-28; PartNumber: LM5175PWPR; PackageReference: PWP0028F; MountType: SMT; ComponentLink1Description: Datasheet Link; ComponentLink1URL: https://sps06.itg.ti.com/sites/KMS/crossdivteams/altium/docs/ComponentDatasheets/LM5175_SNVSA37.pdf; RoHS: Y; Publisher: Texas Instruments; LatestRevisionDate: 2015-02-10; Manufacturer: Texas Instruments